# Altium project sdram_shield.PrjPcb
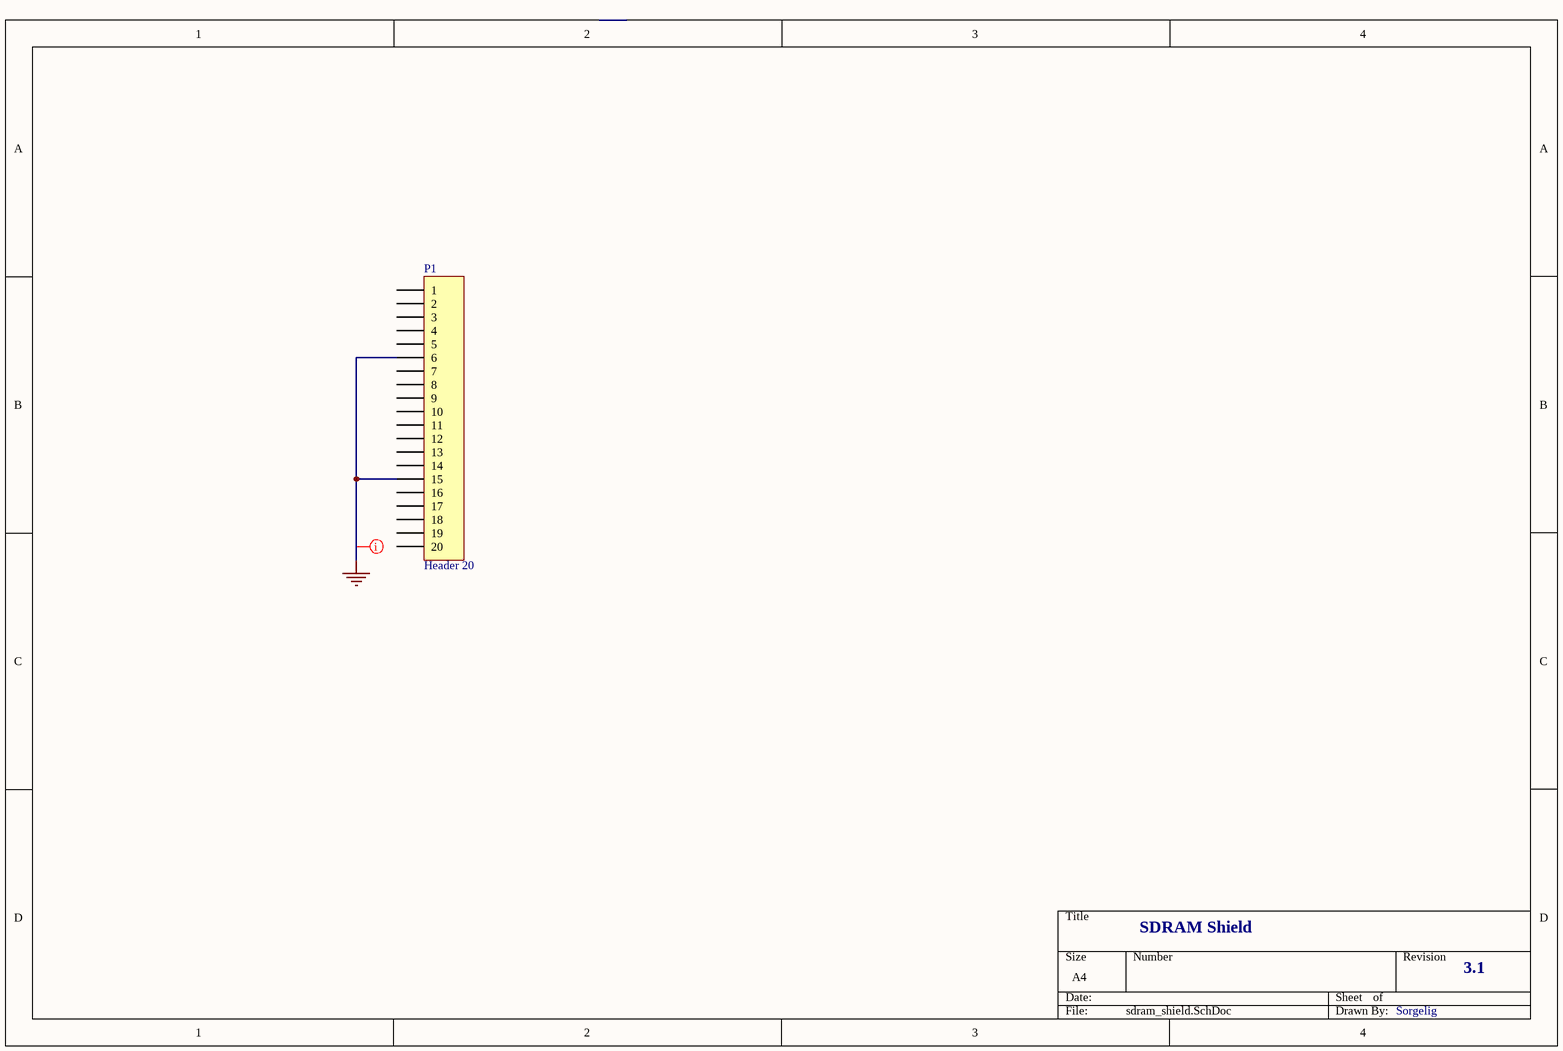
[diagram p0: sdram_shield.SchDoc]
1 sheet, 1 parts. Net scope: global (net labels, ports and power ports of the same name join across sheets).
Board file: sdram_shield.PcbDoc

## Sheet sdram_shield.SchDoc
size A4

### Parts
P1  Header 20  [HDR1X20]

### Nets
GND: P1.6 P1.15

Not connected (* = marked no-connect by the designer): P1 1 2 3 4 5 7 8 9 10 11 12 13 14 16 17 18 19 20

### Layout directives
net class power: GND

### Notes on the sheet
- SDRAM Shield
- 3.1
- Sorgelig

### Library data of the parts
P1 = Header 20: Header, 20-Pin; LatestRevisionDate: 17-Jul-2002; LatestRevisionNote: Re-released for DXP Platform.; Publisher: Altium Limited